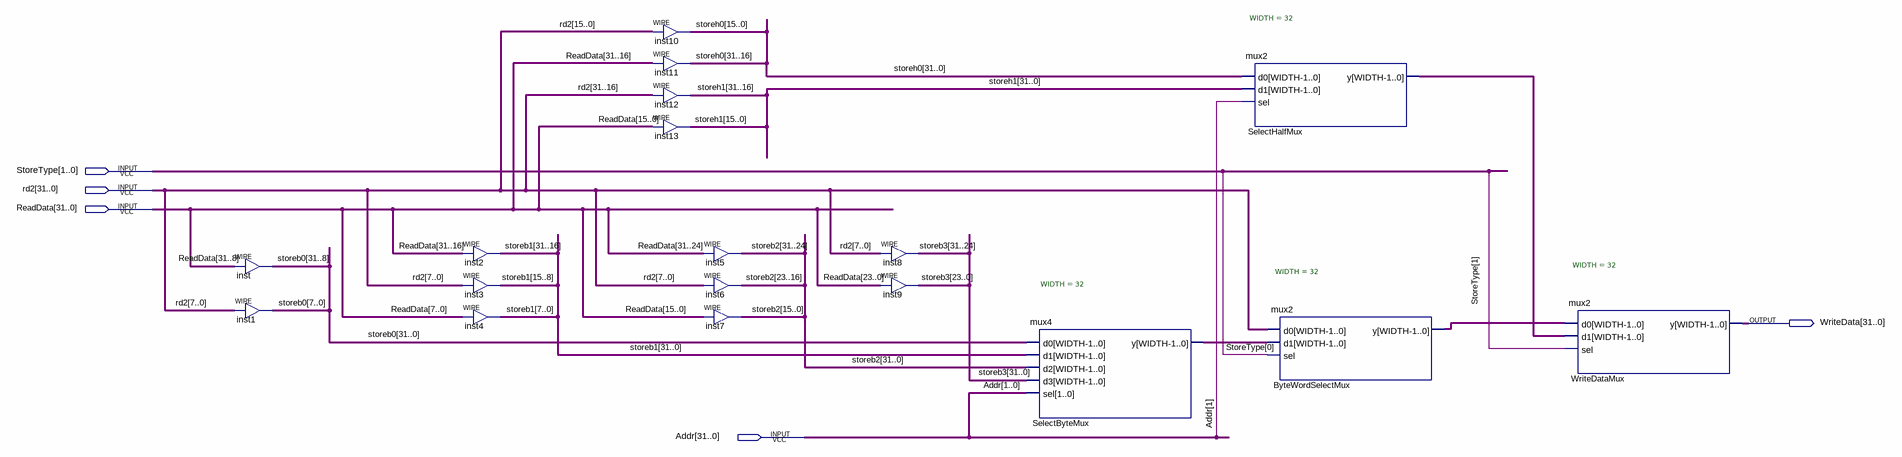
[diagram p0: schematic sheet]
// Quartus schematic write_data.bdf as structural Verilog: 18 symbols, 5 pins
module write_data (
  input  [1:0] StoreType,
  input  [31:0] rd2,
  input  [31:0] ReadData,
  input  [31:0] Addr,
  output [31:0] WriteData
);

  wire [31:0] ByteWordSelectMux_y, SelectByteMux_y, SelectHalfMux_y, storeb0, storeb1, storeb2, storeb3,
       storeh0, storeh1;

  assign storeb0[31:8] = ReadData[31:8];  // WIRE inst
  assign storeb0[7:0] = rd2[7:0];  // WIRE inst1
  assign storeb1[31:16] = ReadData[31:16];  // WIRE inst2
  assign storeb1[15:8] = rd2[7:0];  // WIRE inst3
  assign storeb1[7:0] = ReadData[7:0];  // WIRE inst4
  assign storeh0[15:0] = rd2[15:0];  // WIRE inst10
  assign storeh0[31:16] = ReadData[31:16];  // WIRE inst11
  assign storeh1[31:16] = rd2[31:16];  // WIRE inst12
  assign storeh1[15:0] = ReadData[15:0];  // WIRE inst13
  assign storeb2[31:24] = ReadData[31:24];  // WIRE inst5
  assign storeb2[23:16] = rd2[7:0];  // WIRE inst6
  assign storeb2[15:0] = ReadData[15:0];  // WIRE inst7
  assign storeb3[31:24] = rd2[7:0];  // WIRE inst8
  assign storeb3[23:0] = ReadData[23:0];  // WIRE inst9
  mux4 #(.WIDTH(32)) SelectByteMux (
    .d0(storeb0), .d1(storeb1), .d2(storeb2), .d3(storeb3), .sel(Addr[1:0]), .y(SelectByteMux_y));
  mux2 #(.WIDTH(32)) SelectHalfMux (.d0(storeh0), .d1(storeh1), .sel(Addr[1]), .y(SelectHalfMux_y));
  mux2 #(.WIDTH(32)) ByteWordSelectMux (.d0(rd2), .d1(SelectByteMux_y), .sel(StoreType[0]), .y(ByteWordSelectMux_y));
  mux2 #(.WIDTH(32)) WriteDataMux (.d0(ByteWordSelectMux_y), .d1(SelectHalfMux_y), .sel(StoreType[1]), .y(WriteData));
endmodule
